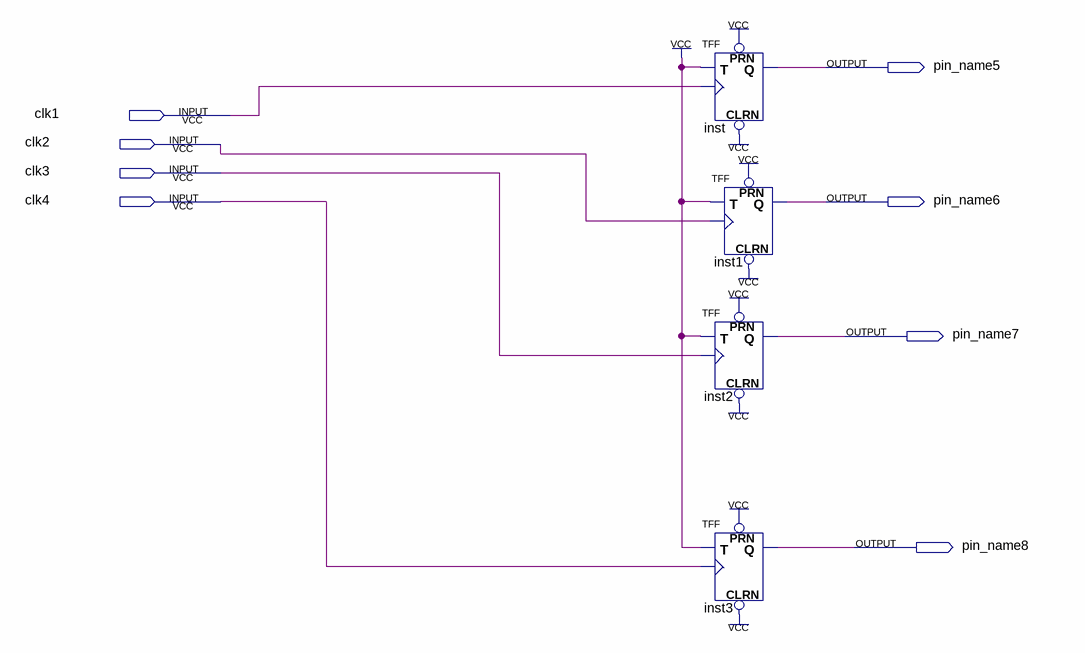
[diagram p0: schematic sheet]
// Quartus schematic flipflopt4.bdf as structural Verilog: 4 symbols, 8 pins
module flipflopt4 (
  input  clk1,
  input  clk2,
  input  clk3,
  input  clk4,
  output pin_name5,
  output pin_name6,
  output pin_name7,
  output pin_name8
);

  TFF inst (.PRN(1'b1), .CLRN(1'b1), .T(1'b1), .CLK(clk1), .Q(pin_name5));
  TFF inst1 (.PRN(1'b1), .CLRN(1'b1), .T(1'b1), .CLK(clk2), .Q(pin_name6));
  TFF inst2 (.PRN(1'b1), .CLRN(1'b1), .T(1'b1), .CLK(clk3), .Q(pin_name7));
  TFF inst3 (.PRN(1'b1), .CLRN(1'b1), .T(1'b1), .CLK(clk4), .Q(pin_name8));
endmodule
